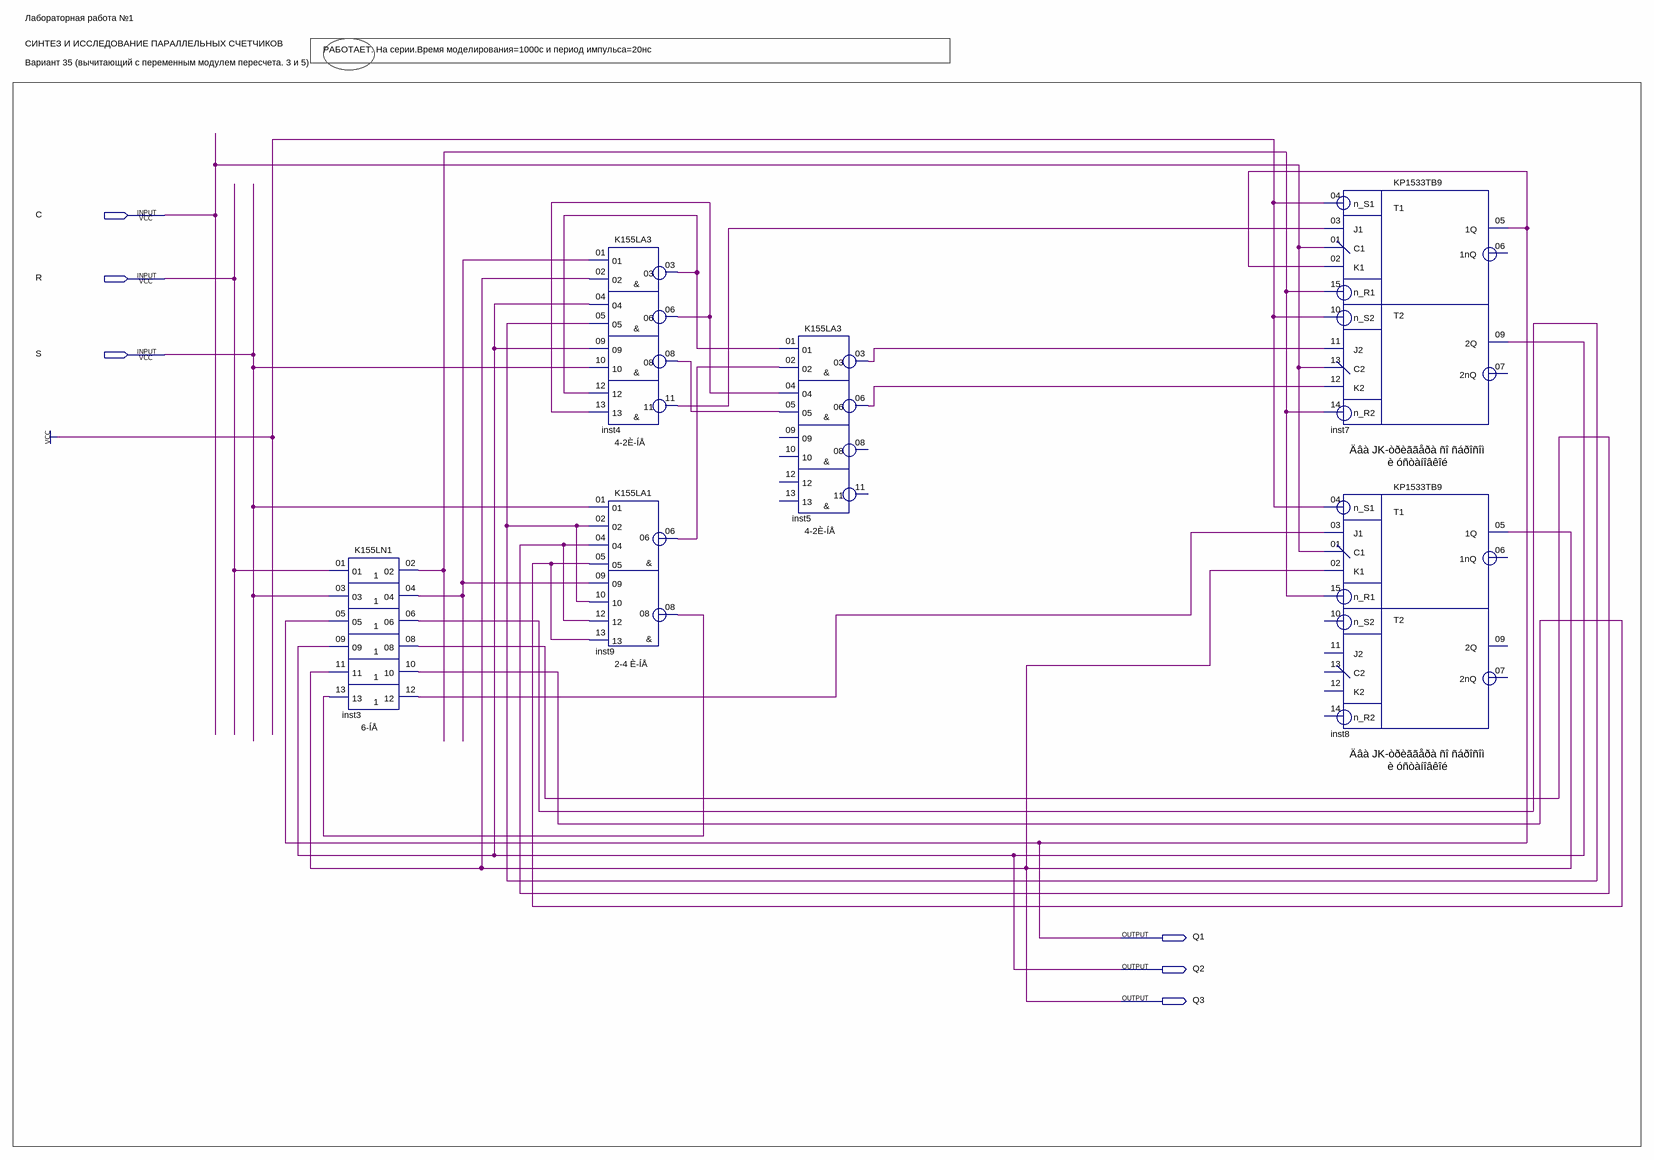
[diagram p0: schematic sheet]
// Quartus schematic 2_lab.bdf as structural Verilog: 6 symbols, 6 pins
module \2_lab  (
  input  C,
  input  R,
  input  S,
  output Q1,
  output Q2,
  output Q3
);

  wire inst3_02, inst3_04, inst3_06, inst3_08, inst3_10, inst3_12, inst4_03, inst4_06, inst4_08, inst4_11,
       inst5_03, inst5_06, inst9_06, inst9_08;

  K155LN1 inst3 (
    .\01 (R), .\03 (S), .\05 (Q1), .\09 (Q2), .\11 (Q3), .\13 (inst9_08), .\02 (inst3_02), .\04 (inst3_04),
    .\06 (inst3_06), .\08 (inst3_08), .\10 (inst3_10), .\12 (inst3_12));
  K155LA3 inst4 (
    .\01 (inst3_04), .\02 (Q3), .\04 (Q2), .\05 (inst3_06), .\09 (Q2), .\10 (S), .\12 (inst4_03),
    .\13 (inst4_06), .\03 (inst4_03), .\06 (inst4_06), .\08 (inst4_08), .\11 (inst4_11));
  K155LA1 inst9 (
    .\01 (S), .\02 (inst3_06), .\04 (inst3_08), .\05 (inst3_10), .\09 (inst3_04), .\10 (inst3_06),
    .\12 (inst3_08), .\13 (inst3_10), .\06 (inst9_06), .\08 (inst9_08));
  K155LA3 inst5 (
    .\01 (inst4_03), .\02 (inst9_06), .\04 (inst4_06), .\05 (inst4_08), .\03 (inst5_03), .\06 (inst5_06));  // open: 09, 10, 12, 13, 08, 11
  KP1533TB9 inst7 (
    .n_S1(1'b1), .J1(inst4_11), .n_R1(inst3_02), .C1(C), .K1(Q1), .n_S2(1'b1), .J2(inst5_03),
    .n_R2(inst3_02), .C2(C), .K2(inst5_06), .\1Q (Q1), .\2Q (Q2));  // open: 1nQ, 2nQ
  KP1533TB9 inst8 (
    .n_S1(1'b1), .J1(inst3_12), .n_R1(inst3_02), .C1(C), .K1(Q3), .\1Q (Q3));  // open: n_S2, J2, n_R2, C2, K2, 1nQ, 2Q, 2nQ

  // Notes on the sheet:
  //   Лабораторная работа №1
  //   СИНТЕЗ И ИССЛЕДОВАНИЕ ПАРАЛЛЕЛЬНЫХ СЧЕТЧИКОВ
  //   РАБОТАЕТ. На серии.Время моделирования=1000с и период импульса=20нс
  //   Вариант 35 (вычитающий с переменным модулем пересчета. 3 и 5)
endmodule
